# EAGLE design microframe (EAGLE 5.10)
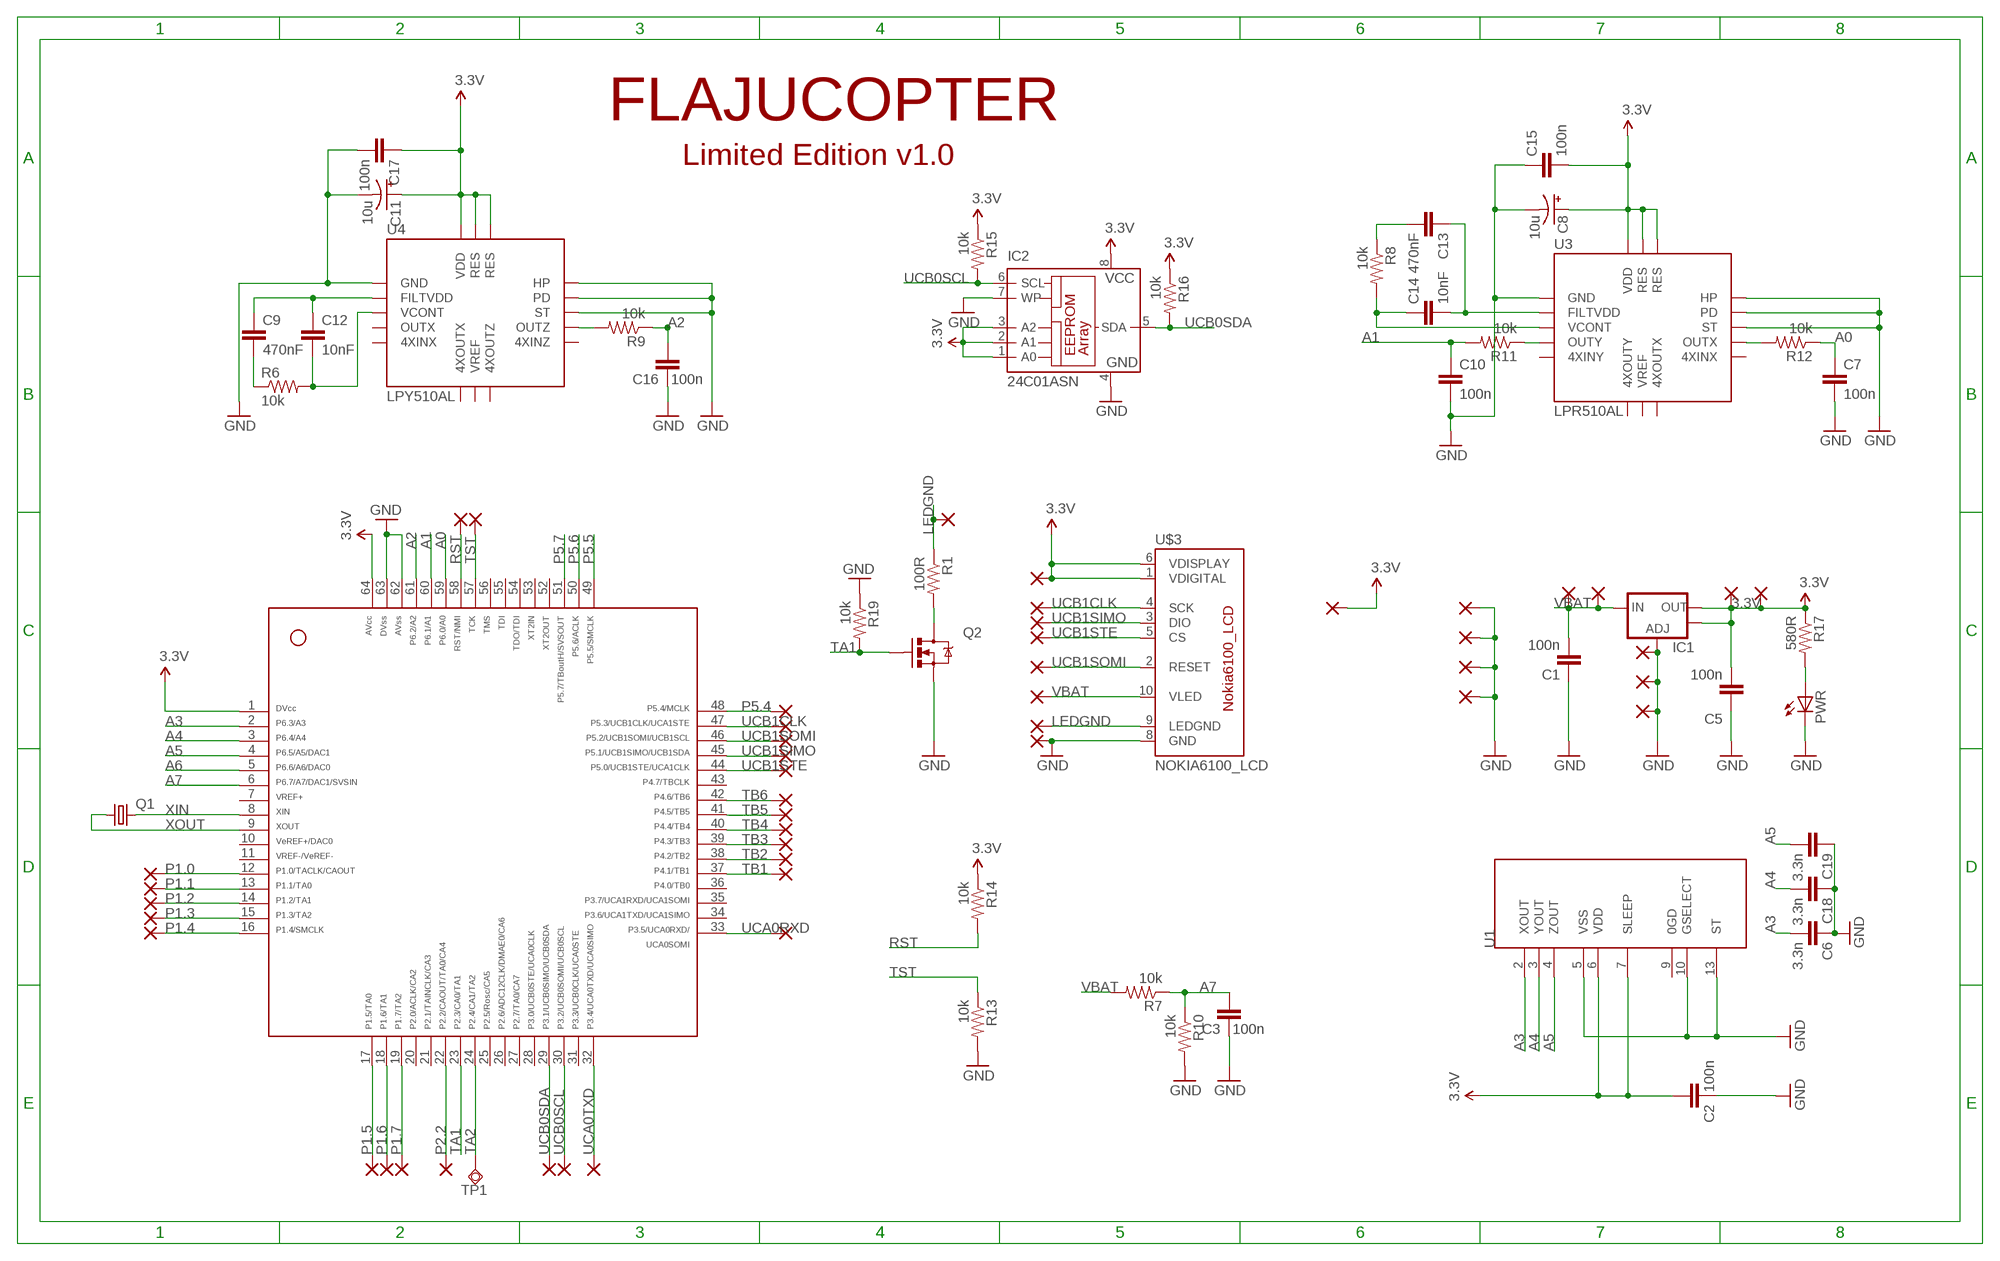
[diagram p0: schematic, sheet 1]

## Parts
C1  100n  CAP0805  [0805]
C2  100n  CAP0805  [0805]
C3  100n  CAP0805  [0805]
C5  100n  CAP0805  [0805]
C6  3.3n  CAP0805  [0805]
C7  100n  CAP0805  [0805]
C8  10u  CPOL-USCT3216  [CT3216]
C9  470nF  CAP0805  [0805]
C10  100n  CAP0805  [0805]
C11  10u  CPOL-USCT3216  [CT3216]
C12  10nF  CAP0805  [0805]
C13  470nF  CAP0805  [0805]
C14  10nF  CAP0805  [0805]
C15  100n  CAP0805  [0805]
C16  100n  CAP0805  [0805]
C17  100n  CAP0805  [0805]
C18  3.3n  CAP0805  [0805]
C19  3.3n  CAP0805  [0805]
IC1  V_REG_LM1117SOT223  [SOT223]
IC2  24C01ASN  [SO-08]
PAD1  SMD2  [SMD1,27-2,54]
PAD2  SMD2  [SMD1,27-2,54]
PAD3  SMD2  [SMD1,27-2,54]
PAD4  SMD2  [SMD1,27-2,54]
PAD5  SMD2  [SMD1,27-2,54]
PAD6  SMD2  [SMD1,27-2,54]
PAD7  SMD2  [SMD1,27-2,54]
PAD8  SMD2  [SMD1,27-2,54]
PAD9  SMD2  [SMD1,27-2,54]
PAD10  SMD2  [SMD1,27-2,54]
PAD11  SMD2  [SMD1,27-2,54]
PAD12  SMD2  [SMD1,27-2,54]
PAD13  SMD2  [SMD1,27-2,54]
PAD14  SMD2  [SMD1,27-2,54]
PAD15  SMD2  [SMD1,27-2,54]
PAD16  SMD2  [SMD1,27-2,54]
PAD17  SMD2  [SMD1,27-2,54]
PAD18  SMD2  [SMD1,27-2,54]
PAD19  SMD2  [SMD1,27-2,54]
PAD20  SMD2  [SMD1,27-2,54]
PAD21  SMD2  [SMD1,27-2,54]
PAD22  SMD2  [SMD1,27-2,54]
PAD23  SMD2  [SMD1,27-2,54]
PAD24  SMD2  [SMD1,27-2,54]
PAD25  SMD2  [SMD1,27-2,54]
PAD26  SMD2  [SMD1,27-2,54]
PAD27  SMD2  [SMD1,27-2,54]
PAD28  SMD2  [SMD1,27-2,54]
PAD29  SMD2  [SMD1,27-2,54]
PAD30  SMD2  [SMD1,27-2,54]
PAD31  SMD2  [SMD1,27-2,54]
PAD32  SMD2  [SMD1,27-2,54]
PAD33  SMD2  [SMD1,27-2,54]
PAD34  SMD2  [SMD1,27-2,54]
PAD35  SMD2  [SMD1,27-2,54]
PAD36  SMD2  [SMD1,27-2,54]
PAD37  SMD2  [SMD1,27-2,54]
PAD38  SMD2  [SMD1,27-2,54]
PAD39  SMD2  [SMD1,27-2,54]
PAD40  SMD2  [SMD1,27-2,54]
PAD41  SMD2  [SMD1,27-2,54]
PAD42  SMD2  [SMD1,27-2,54]
PAD43  SMD2  [SMD1,27-2,54]
PAD44  SMD2  [SMD1,27-2,54]
PAD45  SMD2  [SMD1,27-2,54]
PAD46  SMD2  [SMD1,27-2,54]
PAD47  SMD2  [SMD1,27-2,54]
PWR  LEDCHIPLED_0603  [CHIPLED_0603]
Q1  CRYSTALHC49S  [HC49/S]
Q2  MOSFET-NCHANNELSMD  [SOT23-3]
R1  100R  RESISTOR  [0805]
R6  10k  RESISTOR  [0805]
R7  10k  RESISTOR  [0805]
R8  10k  RESISTOR  [0805]
R9  10k  RESISTOR  [0805]
R10  10k  RESISTOR  [0805]
R11  10k  RESISTOR  [0805]
R12  10k  RESISTOR  [0805]
R13  10k  RESISTOR  [0805]
R14  10k  RESISTOR  [0805]
R15  10k  RESISTOR  [0805]
R16  10k  RESISTOR  [0805]
R17  580R  RESISTOR  [0805]
R19  10k  RESISTOR  [0805]
TP1  TPSQTP13R  [TP13R]
U1  MMA7361  [LGA14]
U3  LPR510AL  ST-GYRO-PRLGA  [ST-GYRO]
U4  LPY510AL  ST-GYRO-PYSMD  [ST-GYRO]
U$1  F261X---PM64  [PM/PAG64]
U$3  NOKIA6100_LCD  [NOKIA6100_LCD]

## Nets
3.3V: C2.2 C5.2 C8.+ C11.+ C15.2 C17.1 IC1.2(OUT) IC1.4(OUT) IC2.1(A0) IC2.2(A1) IC2.3(A2) IC2.8(VCC) PAD26.1(P) PAD28.1(P) PAD36.1(P) PAD44.1(P) R14.1 R15.1 R16.1 R17.1 U1.6(VDD) U1.7(SLEEP) U3.14(RES) U3.15(RES) U3.16(VDD) U4.14(RES) U4.15(RES) U4.16(VDD) U$1.1 U$1.64 U$3.1(VDIGITAL) U$3.6(VDISPLAY)
A0: C7.1 R12.1 U$1.59
A1: C10.1 R11.2 U$1.60
A2: C16.2 R9.1 U$1.61
A3: C6.2 U1.2(XOUT) U$1.2
A4: C18.2 U1.3(YOUT) U$1.3
A5: C19.2 U1.4(ZOUT) U$1.4
A6: U$1.5
A7: C3.2 R7.1 R10.1 U$1.6
GND: C1.1 C2.1 C3.1 C5.1 C6.1 C7.2 C8.- C10.2 C11.- C15.1 C16.1 C17.2 C18.1 C19.1 IC1.1(ADJ) IC2.4(GND) IC2.7(WP) PAD22.1(P) PAD23.1(P) PAD24.1(P) PAD25.1(P) PAD37.1(P) PAD43.1(P) PAD46.1(P) PAD47.1(P) PWR.C Q2.2(S) R10.2 R13.2 R19.1 U1.5(VSS) U1.10(GSELECT) U1.13(ST) U3.1(GND) U3.11(ST) U3.12(PD) U3.13(HP) U4.1(GND) U4.11(ST) U4.12(PD) U4.13(HP) U$1.62 U$1.63 U$3.8(GND)
LEDGND: PAD35.1(P) PAD45.1(P) R1.1 U$3.9(LEDGND)
N$1: C13.2 R8.1
N$2: R11.1 U3.4(OUTY)
N$3: PWR.A R17.2
N$4: Q2.3(D) R1.2
N$5: C9.1 C12.1 U4.2(FILTVDD)
N$10: C9.2 R6.1
N$12: C12.2 R6.2 U4.3(VCONT)
N$13: R9.2 U4.10(OUTZ)
N$14: C13.1 C14.2 U3.2(FILTVDD)
N$19: R12.2 U3.10(OUTX)
N$20: C14.1 R8.2 U3.3(VCONT)
P1.0: PAD1.1(P) U$1.12
P1.1: PAD2.1(P) U$1.13
P1.2: PAD3.1(P) U$1.14
P1.3: PAD4.1(P) U$1.15
P1.4: PAD5.1(P) U$1.16
P1.5: PAD6.1(P) U$1.17
P1.6: PAD7.1(P) U$1.18
P1.7: PAD8.1(P) U$1.19
P2.2: PAD9.1(P) U$1.22
P5.4: PAD29.1(P) U$1.48
P5.5: U$1.49
P5.6: U$1.50
P5.7: U$1.51
RST: PAD20.1(P) R14.2 U$1.58
TA1: Q2.1(G) R19.2 U$1.23
TA2: TP1.TP U$1.24
TB1: PAD10.1(P) U$1.37
TB2: PAD11.1(P) U$1.38
TB3: PAD12.1(P) U$1.39
TB4: PAD13.1(P) U$1.40
TB5: PAD14.1(P) U$1.41
TB6: PAD15.1(P) U$1.42
TST: PAD21.1(P) R13.1 U$1.57
UCA0RXD: PAD39.1(P) U$1.33
UCA0TXD: PAD38.1(P) U$1.32
UCB0SCL: IC2.6(SCL) PAD40.1(P) R15.2 U$1.30
UCB0SDA: IC2.5(SDA) PAD41.1(P) R16.2 U$1.29
UCB1CLK: PAD19.1(P) PAD30.1(P) U$1.47 U$3.4(SCK)
UCB1SIMO: PAD17.1(P) PAD31.1(P) U$1.45 U$3.3(DIO)
UCB1SOMI: PAD18.1(P) PAD33.1(P) U$1.46 U$3.2(RESET)
UCB1STE: PAD16.1(P) PAD32.1(P) U$1.44 U$3.5(CS)
VBAT: C1.2 IC1.3(IN) PAD27.1(P) PAD34.1(P) PAD42.1(P) R7.2 U$3.10(VLED)
XIN: Q1.2 U$1.8
XOUT: Q1.1 U$1.9
Unconnected: U1.9(0GD) U3.5(4XINY) U3.6(4XOUTY) U3.7(VREF) U3.8(4XOUTX) U3.9(4XINX) U4.4(OUTX) U4.5(4XINX) U4.6(4XOUTX) U4.7(VREF) U4.8(4XOUTZ) U4.9(4XINZ) U$1.7 U$1.10 U$1.11 U$1.20 U$1.21 U$1.25 U$1.26 U$1.27 U$1.28 U$1.31 U$1.34 U$1.35 U$1.36 U$1.43 U$1.52 U$1.53 U$1.54 U$1.55 U$1.56

## Notes on the sheet
- FLAJUCOPTER
- Limited Edition v1.0

## Library data of the parts
C1-C3 C5-C7 C9 C10 C12-C19 = SparkFun:CAP: Capacitor Standard 0603 ceramic capacitor, and 0.1" leaded capacitor.
C8 C11 = rcl:CPOL-US: POLARIZED CAPACITOR, American symbol
IC1 = SparkFun:V_REG_LM1117: Voltage Regulator LM1117 Standard adjustable voltage regulator but in SMD form. Spark Fun Electronics SKU : COM-00595
IC2 = microchip:24C*: Serial EEPROM 1 K/2 K/4 K
PAD1-PAD47 = wirepad:SMD2: SMD PAD
PWR = led:LED: LED OSRAM: - CHIPLED LG R971, LG N971, LY N971, LG Q971, LY Q971, LO R971, LY R971 LH N974, LH R974 LS Q976, LO Q976, LY Q976 LO Q996 - Hyper CHIPLED LW Q18S LB Q993, LB Q99A, LB R99A - SideLED LS A670, LO A670, LY A670, LG A670, LP A670 LB A673, LV A673, LT A673, LW A673 LH A674 LY A675 LS A676, LA A676, LO A676, LY A676, LW A676 LS A679, LY A679, LG A679 - Hyper Micro SIDELED® LS Y876, LA Y876, LO Y876, LY Y876 LT Y87S - SmartLED LW L88C, LW L88S LB L89C, LB L89S, LG L890 LS L89K, LO L89K, LY L89K LS L896, LA L896, LO L896, LY L896 - TOPLED LS T670, LO T670, LY T670, LG T670, LP T670 LSG T670, LSP T670, LSY T670, LOP T670, LYG T670 LG T671, LOG T671, LSG T671 LB T673, LV T673, LT T673, LW T673 LH T674 LS T676, LA T676, LO T676, LY T676, LB T676, LH T676, LSB T676, LW T676 LB T67C, LV T67C, LT T67C, LS T67K, LO T67K, LY T67K, LW E67C LS E67B, LA E67B, LO E67B, LY E67B, LB E67C, LV E67C, LT E67C LW T67C LS T679, LY T679, LG T679 LS T770, LO T770, LY T770, LG T770, LP T770 LB T773, LV T773, LT T773, LW T773 LH T774 LS E675, LA E675, LY E675, LS T675 LS T776, LA T776, LO T776, LY T776, LB T776 LHGB T686 LT T68C, LB T68C - Hyper Mini TOPLED® LB M676 - Mini TOPLED Santana® LG M470 LS M47K, LO M47K, LY M47K Source: http://www.osram.convergy.de LUXEON: - LUMILED® LXK2-PW12-R00, LXK2-PW12-S00, LXK2-PW14-U00, LXK2-PW14-V00 LXK2-PM12-R00, LXK2-PM12-S00, LXK2-PM14-U00 LXK2-PE12-Q00, LXK2-PE12-R00, LXK2-PE12-S00, LXK2-PE14-T00, LXK2-PE14-U00 LXK2-PB12-K00, LXK2-PB12-L00, LXK2-PB12-M00, LXK2-PB14-N00, LXK2-PB14-P00, LXK2-PB14-Q00 LXK2-PR12-L00, LXK2-PR12-M00, LXK2-PR14-Q00, LXK2-PR14-R00 LXK2-PD12-Q00, LXK2-PD12-R00, LXK2-PD12-S00 LXK2-PH12-R00, LXK2-PH12-S00 LXK2-PL12-P00, LXK2-PL12-Q00, LXK2-PL12-R00 Source: www.luxeon.com KINGBRIGHT: KA-3528ASYC Source: www.kingbright.com
Q1 = crystal:CRYSTAL: CRYSTAL
Q2 = SparkFun:MOSFET-NCHANNEL
R1 R6-R17 R19 = SparkFun:RESISTOR: Resistor Basic schematic elements and footprints for 0603, 1206, and PTH 1/10th watt (small) resistors.
TP1 = testpad:TPSQ: Test pad
U1 = SparkFun:MMA7361
U3 = SparkFun:ST-GYRO-PR
U4 = SparkFun:ST-GYRO-PY
U$1 = TI_MSP430_v15:F261X---PM64: ***MSP430F261x***PM64
U$3 = SparkFun:NOKIA6100_LCD: Nokia 6100 Color LCD Schematic element and footprint production proven but could use some touching up. Spark Fun Electronics SKU : LCD-00569. Mating SMD connector : LCD-00570

## Board
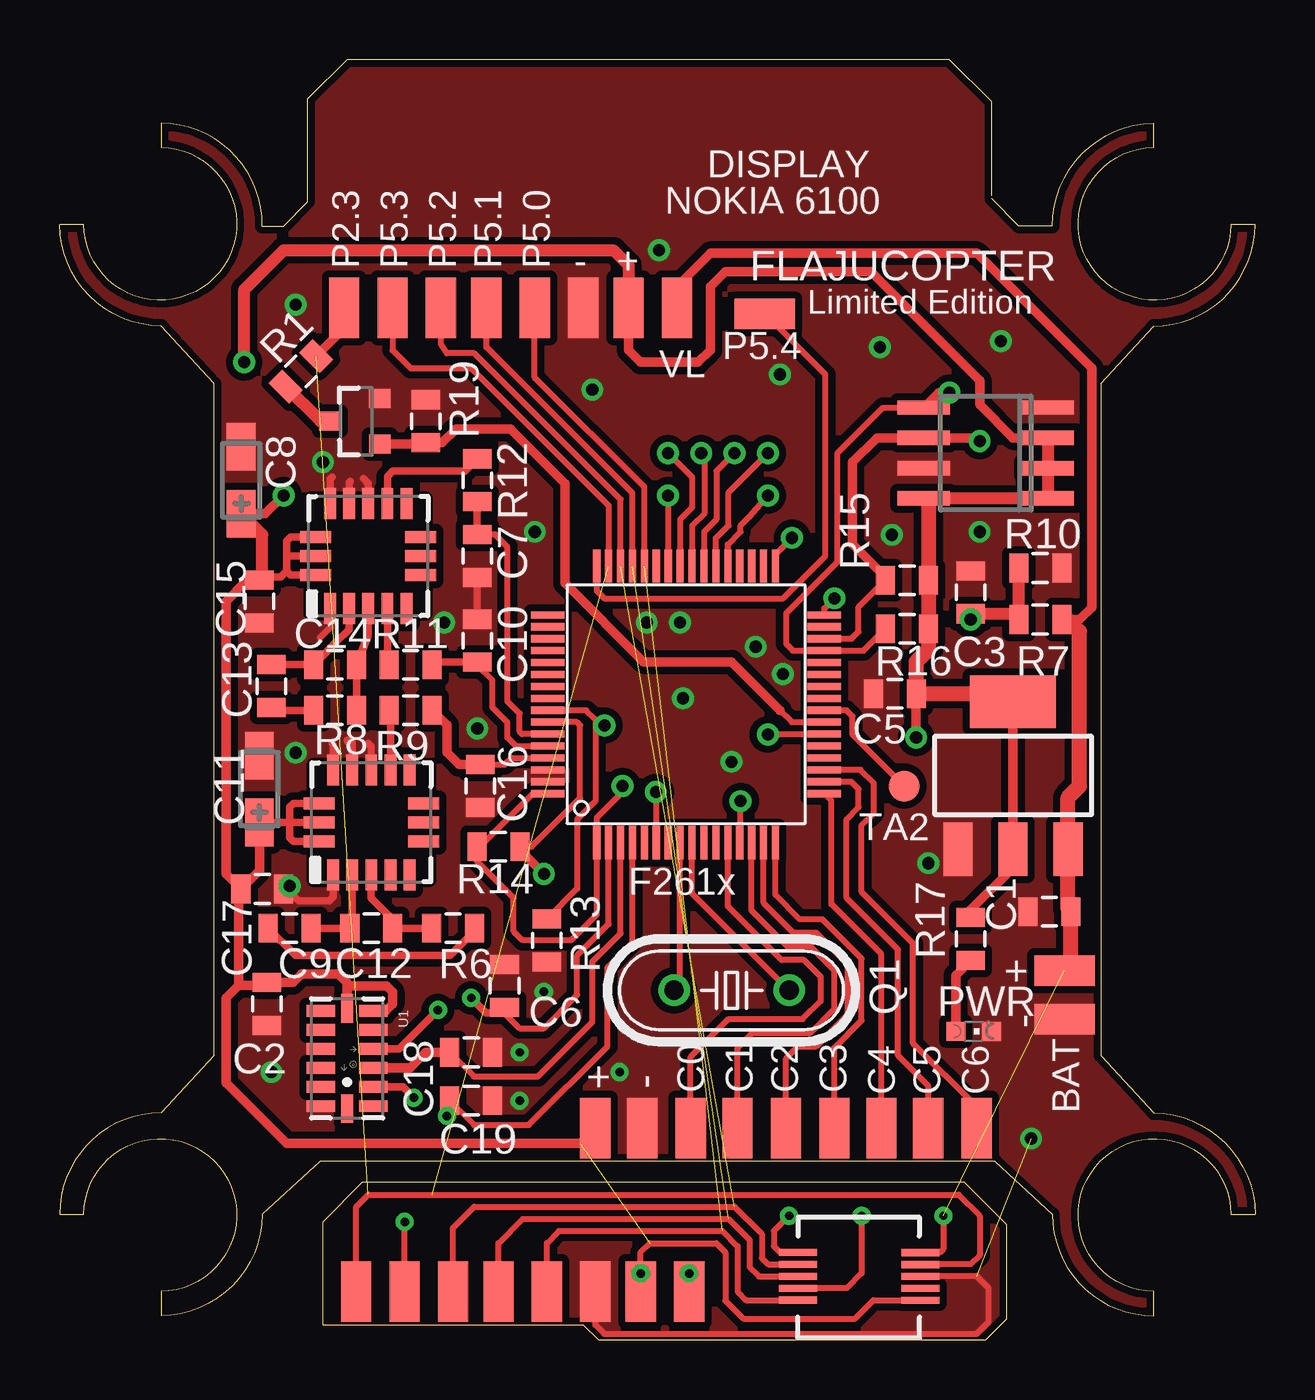
[diagram p1: board, top side]
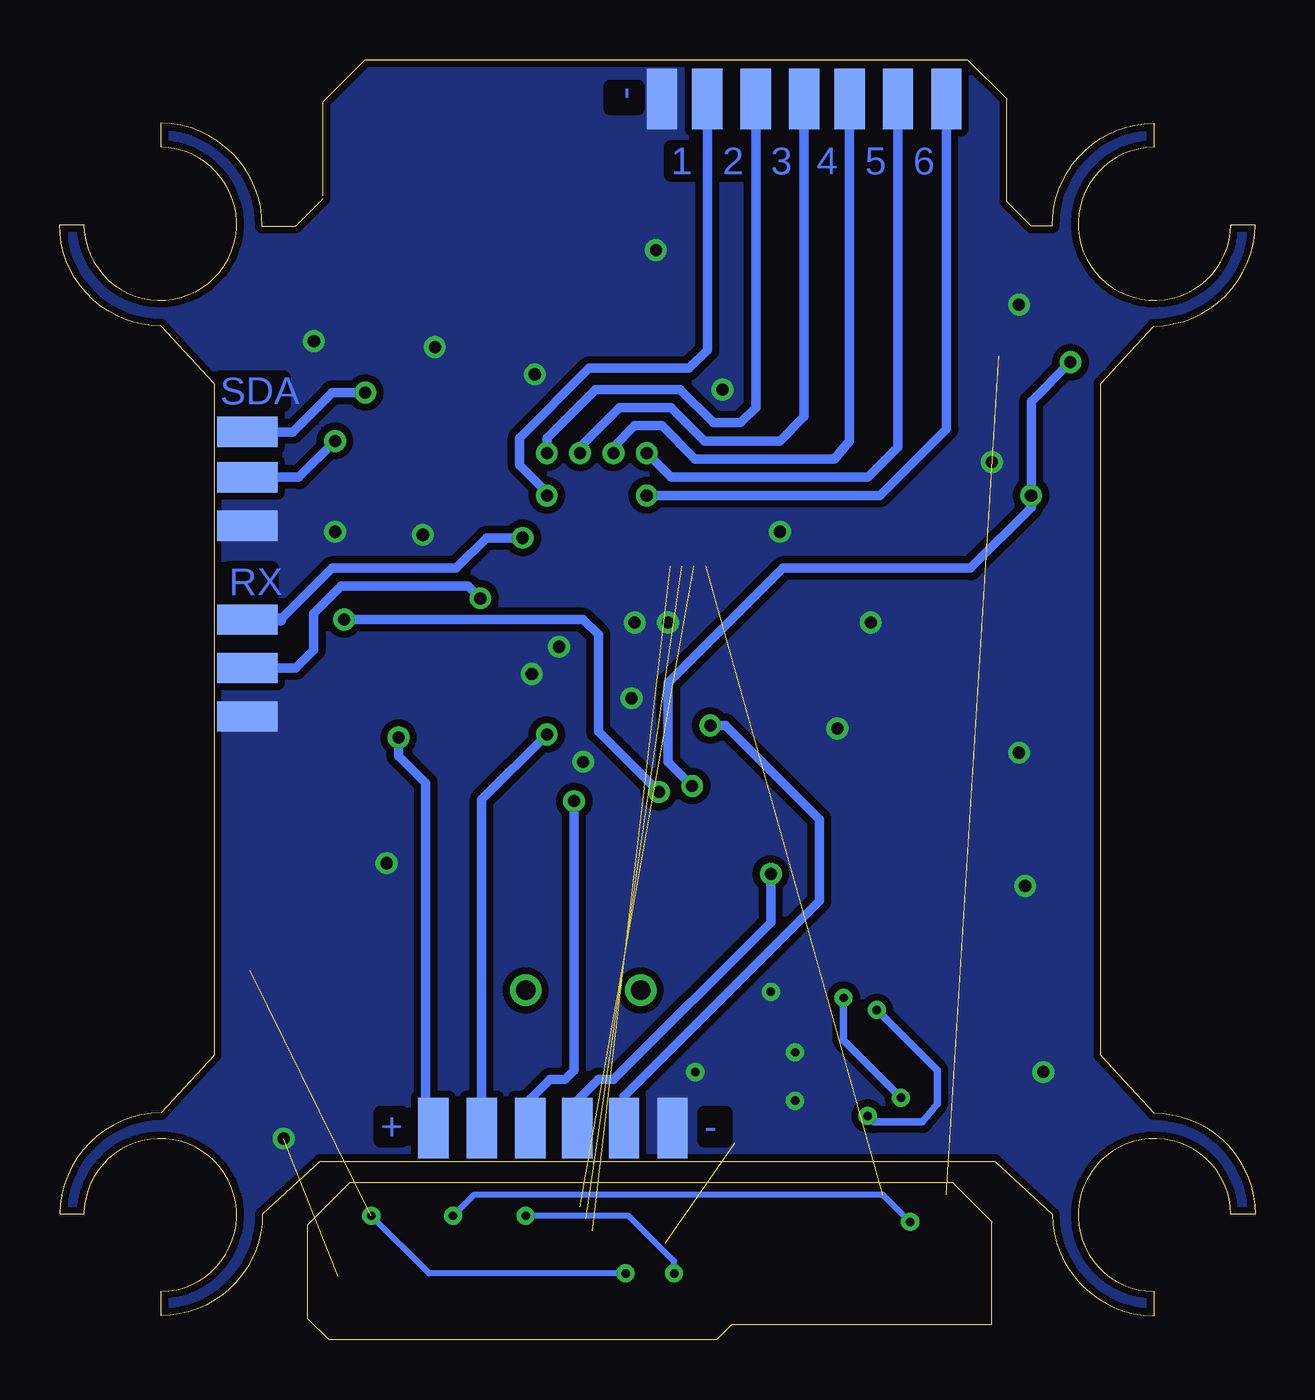
[diagram p2: board, bottom side, seen from below]

Size 50.17 x 53.72 mm. Coordinates in mm from the lower left corner, seen from the top.
Outline: 39.12,47.88 40.26,46.74 41.66,46.74 arc-89 45.91,51.05 45.91,50.04 arc269 49.15,46.8 50.17,46.8 arc-90 45.91,42.54 43.69,40.13 43.69,11.94 45.91,9.52 arc-89 50.17,5.27 49.15,5.27 arc269 45.91,2.03 45.91,1.02 arc-90 41.66,5.27 39.24,7.49 10.92,7.49 8.51,5.27 arc-89 4.25,1.02 4.25,2.03 arc269 1.02,5.27 0,5.27 arc-90 4.25,9.52 6.48,11.94 6.48,40.13 4.25,42.54 arc-89 0,46.8 1.02,46.8 arc269 4.25,50.04 4.25,51.05 arc-90 8.51,46.74 9.4,46.74 10.41,47.75 10.41,52.07 12.07,53.72 37.34,53.72 39.12,51.94 39.12,48.01
Outline: 39.75,4.83 37.97,6.6 12.7,6.6 11.05,4.95 11.05,0.63 21.97,0.63 22.61,0 38.86,0 39.75,0.89 39.75,4.83
Copper layers (1*16): Top 0.035mm / dielectric 1.5mm / Bottom 0.035mm
Design rules "default *": minimum track width 10mil, minimum drill 24mil, track to track 8mil, track to pad 8mil, pad to pad 8mil, via to via 8mil, smd to smd 8mil, copper to edge 5mil, drill to drill 8mil, minimum pad ring 10mil, minimum via ring 8mil, stop-mask expansion 4mil, vias tented up to drill 0mil, thermal gap 10mil
tRestrict: area 10.5,30.5 to 15.4,35.3; area 10.7,19.3 to 15.5,24.1; area 11.6,10.3 to 12.6,13.3

### Footprints (pad centres in the part's own frame; a part is rotated, then mirrored left to right if it is on the bottom)
0805 = smd 0.8 x 1.2: 1 -0.9,0; 2 0.9,0
CT3216 = smd 2 x 1.2: + -1.4,0; - 1.4,0
SOT223 = smd 1.219 x 2.235: 1 -2.311,-3.099; 2 0,-3.099; 3 2.311,-3.099 | smd 3.6 x 2.2: 4 0,3.099
SO-08 = smd 0.6 x 2.2: 1 -1.905,-2.6; 2 -0.635,-2.6; 3 0.635,-2.6; 4 1.905,-2.6; 5 1.905,2.6; 6 0.635,2.6; 7 -0.635,2.6; 8 -1.905,2.6
SMD1,27-2,54 = smd 1.27 x 2.54: 1 0,0
CHIPLED_0603 = smd 0.8 x 0.8: A 0,-0.75; C 0,0.75
HC49/S = drill 0.813 round: 1 -2.413,0; 2 2.413,0
SOT23-3 = smd 0.8 x 0.9: 1 -0.95,-1; 2 0.95,-1; 3 0,1.1
TP13R = smd 1.3 x 1.3: TP 0,0
LGA14 = smd 0.5 x 1.2: 1 2,1.1; 2 1.2,1.1; 3 0.4,1.1; 4 -0.4,1.1; 5 -1.2,1.1; 6 -2,1.1; 8 -2,-1.1; 9 -1.2,-1.1; 10 -0.4,-1.1; 11 0.4,-1.1; 12 1.2,-1.1; 13 2,-1.1 | smd 1.2 x 0.5: 7 -2.1,0; 14 2.1,0
ST-GYRO = smd 1.3 x 0.5: 1 -2.2,1.6; 2 -2.2,0.8; 3 -2.2,0; 4 -2.2,-0.8; 5 -2.2,-1.6; 9 2.2,-1.6; 10 2.2,-0.8; 11 2.2,0; 12 2.2,0.8; 13 2.2,1.6 | smd 0.5 x 1.3: 6 -0.8,-2.2; 7 0,-2.2; 8 0.8,-2.2; 14 0.8,2.2; 15 0,2.2; 16 -0.8,2.2
PM/PAG64 = smd 1.4 x 0.3: 1 -5.8,3.75; 2 -5.8,3.25; 3 -5.8,2.75; 4 -5.8,2.25; 5 -5.8,1.75; 6 -5.8,1.25; 7 -5.8,0.75; 8 -5.8,0.25; 9 -5.8,-0.25; 10 -5.8,-0.75; 11 -5.8,-1.25; 12 -5.8,-1.75; 13 -5.8,-2.25; 14 -5.8,-2.75; 15 -5.8,-3.25; 16 -5.8,-3.75; 33 5.8,-3.75; 34 5.8,-3.25; 35 5.8,-2.75; 36 5.8,-2.25; 37 5.8,-1.75; 38 5.8,-1.25; 39 5.8,-0.75; 40 5.8,-0.25; 41 5.8,0.25; 42 5.8,0.75; 43 5.8,1.25; 44 5.8,1.75; 45 5.8,2.25; 46 5.8,2.75; 47 5.8,3.25; 48 5.8,3.75 | smd 0.3 x 1.4: 17 -3.75,-5.8; 18 -3.25,-5.8; 19 -2.75,-5.8; 20 -2.25,-5.8; 21 -1.75,-5.8; 22 -1.25,-5.8; 23 -0.75,-5.8; 24 -0.25,-5.8; 25 0.25,-5.8; 26 0.75,-5.8; 27 1.25,-5.8; 28 1.75,-5.8; 29 2.25,-5.8; 30 2.75,-5.8; 31 3.25,-5.8; 32 3.75,-5.8; 49 3.75,5.8; 50 3.25,5.8; 51 2.75,5.8; 52 2.25,5.8; 53 1.75,5.8; 54 1.25,5.8; 55 0.75,5.8; 56 0.25,5.8; 57 -0.25,5.8; 58 -0.75,5.8; 59 -1.25,5.8; 60 -1.75,5.8; 61 -2.25,5.8; 62 -2.75,5.8; 63 -3.25,5.8; 64 -3.75,5.8
NOKIA6100_LCD = smd 1.6 x 0.3: 1 -2.415,1.131; 2 -2.415,0.631; 3 -2.415,0.131; 4 -2.415,-0.369; 5 -2.415,-0.869; 6 2.719,-0.877; 7 2.719,-0.377; 8 2.719,0.123; 9 2.719,0.623; 10 2.719,1.123

### Placement (x,y rotation side)
C1  41.53,17.97 0 top
C2  8.7,14.1 90 top
C3  38.23,31.37 270 top
C5  35.05,27.11 0 top
C6  18.67,14.86 270 top
C7  17.53,32.89 270 top
C8  7.62,36.07 90 top
C9  9.65,17.27 180 top
C10  17.53,29.34 90 top
C11  8.38,23.11 90 top
C12  13.08,17.27 0 top
C13  8.89,27.43 270 top
C14  11.56,28.32 180 top
C15  8.38,30.99 90 top
C16  17.65,23.24 90 top
C17  8.51,18.92 0 top
C18  17.27,12.06 180 top
C19  17.27,10.03 180 top
IC1  40,23.69 0 top
IC2  38.86,37.21 90 top
PAD1  26.48,8.89 0 top
PAD2  30.42,8.89 0 bottom
PAD3  28.45,8.89 0 top
PAD4  30.48,8.89 0 top
PAD5  32.51,8.89 0 top
PAD6  34.48,8.89 180 top
PAD7  36.45,8.89 0 top
PAD8  38.48,8.89 0 top
PAD9  32.45,8.89 0 bottom
PAD10  22.99,52.07 0 bottom
PAD11  20.95,52.07 0 bottom
PAD12  18.92,52.07 0 bottom
PAD13  17.02,52.07 0 bottom
PAD14  14.99,52.07 0 bottom
PAD15  12.95,52.07 0 bottom
PAD16  19.94,43.31 0 top
PAD17  18.41,2.03 0 top
PAD18  16,43.31 0 top
PAD19  13.97,43.31 0 top
PAD20  28.45,8.89 0 bottom
PAD21  26.48,8.89 0 bottom
PAD22  24.45,8.89 0 bottom
PAD23  42.17,13.45 90 top
PAD24  24.89,52.07 180 bottom
PAD25  24.45,8.89 0 top
PAD26  34.48,8.89 0 bottom
PAD27  42.16,15.49 90 top
PAD28  22.48,8.89 0 top
PAD29  29.59,43.05 90 top
PAD30  14.48,2.03 0 top
PAD31  17.91,43.31 0 top
PAD32  20.45,2.03 0 top
PAD33  16.51,2.03 0 top
PAD34  25.91,43.31 0 top
PAD35  11.94,43.31 0 top
PAD36  23.88,43.31 0 top
PAD37  21.97,43.31 0 top
PAD38  42.29,28.19 270 bottom
PAD39  42.29,30.23 270 bottom
PAD40  42.29,36.2 270 bottom
PAD41  42.29,38.1 270 bottom
PAD42  26.42,2.03 0 top
PAD43  22.48,2.03 0 top
PAD44  24.38,2.03 0 top
PAD45  12.45,2.03 0 top
PAD46  42.29,26.16 270 bottom
PAD47  42.29,34.16 270 bottom
PWR  38.35,12.95 270 top
Q1  28.19,14.67 180 top
Q2  12.45,38.54 90 top
R1  10.13,40.64 225 top
R6  16.51,17.27 180 top
R7  41.15,30.23 0 top
R8  11.56,26.42 0 top
R9  14.73,26.42 180 top
R10  41.15,32.38 0 top
R11  14.73,28.32 0 top
R12  17.53,36.07 90 top
R13  20.45,16.76 270 top
R14  18.41,20.7 0 top
R15  35.56,31.88 180 top
R16  35.56,29.84 180 top
R17  38.23,16.83 270 top
R19  15.37,38.54 270 top
TP1  35.43,23.24 0 top
U1  12.07,11.81 270 top
U3  12.95,32.89 90 top
U4  13.08,21.72 90 top
U$1  26.29,26.67 90 top
U$3  33.4,2.54 0 top

### Tracks (layer width: path | path; a pad name or v marks a point on that pad's centre or on a via)
3.3V  (via drill 0.36, 0.51)  (1 unrouted)
  Top 0.254: U$1.64 19.87,22.92 17.65,20.7 R14.1 17.53,20.07 19.05,18.54 19.05,17.14 19.43,16.76 21.46,16.76 22.54,17.84 U$1.1 22.54,21.9 23.62,22.99 v23.62,23.24 | U$3.6 34.15,1.66 33.38,0.89 28.7,0.89 27.94,1.65 27.94,3.68 27.56,4.06 24.77,4.06 24.38,3.68 v24.38,2.79 PAD44.1 | U$3.1 31.06,3.68 30.23,3.68 29.97,3.94 29.97,4.57 v30.61,5.21
  Top 0.305: 9.65,21.72 U4.15 | 9.65,21.72 C11.+ | U4.14 9.82,22.52 9.65,22.35 9.65,21.72 | U4.16 9.82,20.92 9.65,21.08 9.65,21.72 | 9.53,32.89 U3.15 | 9.53,32.89 9.53,33.53 9.69,33.69 U3.14 | U3.16 9.69,32.09 9.53,32.26 | 9.53,32.26 9.53,32.89 | C17.1 7.62,18.91 | 8.51,32.01 9.28,32.01 9.53,32.26
  Top 0.406: R17.1 38.23,18.03 40,19.81 IC1.2 IC1.4 39.67,27.11 | PAD28.1 21.84,8.25 9.53,8.25 6.99,10.79 6.99,14.35 7.5,14.87 | C15.2 8.24,31.75 7.75,31.75 6.99,30.99 6.99,19.55 C17.1 | C11.+ 8.38,19.7 C17.1 | 35.94,27.13 v35.94,25.27 | IC2.3 40,37.85 38.61,39.24 38.61,40.26 34.04,44.83 27.94,44.83 27.3,44.2 27.3,41.53 26.8,41.02 24.38,41.02 23.88,41.53 PAD36.1 | C8.+ 8.63,34.67 v9.4,35.43 | C17.1 7.5,18.92 7.5,14.87 | 7.5,14.87 8.7,14.87 C2.2 9.79,15 10.16,15.37 11.68,15.37 12.07,14.99 | 12.07,14.99 U1.7 | U1.6 13.68,13.81 13.97,14.1 13.97,14.61 13.72,14.86 12.19,14.86 12.07,14.99
  Top 0.508: C8.+ 8.51,33.78 8.51,32.01 C15.2 | IC2.8 IC2.1 IC2.2 IC2.3 | PAD36.1 23.88,45.09 23.24,45.72 9.4,45.72 7.75,44.07 v7.75,41.02
  Top 0.635: 39.67,27.11 C5.2 35.94,27.13 35.94,28.45 36.46,28.97 R16.1 R15.1 36.46,35.11 IC2.8
  Bottom 0.254: v30.61,5.21 26.29,5.21 24.38,3.3 v24.38,2.79
  Bottom 0.406: v35.94,25.27 35.94,24.51 34.8,23.37 34.8,9.21 PAD26.1 | v23.62,23.24 24.64,24.26 24.64,27.56 19.81,32.38 11.94,32.38 9.4,34.92 v9.4,35.43 9.4,39.37 v7.75,41.02
A0
  Top 0.254: U$1.59 19.41,25.42 19.3,25.53 19.3,26.29 18.8,26.8 18.8,33.27 18.28,33.79 C7.1
  Top 0.305: C7.1 R12.1
A1
  Top 0.254: U$1.60 19.15,24.92 18.8,25.27 18.8,25.91 18.16,26.54 18.16,27.69 17.53,28.32 C10.1
  Top 0.305: C10.1 15.64,28.44 R11.2
A2
  Top 0.254: U$1.61 18.96,24.42 18.68,24.14 C16.2
  Top 0.406: R9.1 16.26,25.79 16.26,24.64 16.75,24.14 C16.2
A3  (via drill 0.36)
  Top 0.254: C6.2 18.66,13.73 19.3,13.08 20.32,13.08 21.72,14.48 21.72,16.13 23.04,17.45 U$1.2
  Top 0.305: 18.66,13.73 17.9,13.73 v17.27,14.35 | v14.86,10.16 14.41,10.61 U1.2
  Bottom 0.305: v17.27,14.35 17.27,12.57 v14.86,10.16
A4
  Top 0.254: C18.2 17.39,11.05 20.07,11.05 22.35,13.33 22.35,15.88 23.54,17.06 U$1.3
  Top 0.305: C18.2 16.3,11.99
  Top 0.406: U1.3 14.71,11.41 15.37,12.06 C18.2
A5  (via drill 0.36)
  Top 0.254: C19.2 17.39,9.02 19.69,9.02 22.99,12.32 22.99,15.62 24.04,16.67 U$1.4
  Top 0.305: C19.2 16.26,9.92 v16.26,9.4 | v15.88,13.84 14.24,12.21 U1.4
  Bottom 0.305: v16.26,9.4 16,9.14 13.97,9.14 13.34,9.91 13.34,11.3 v15.88,13.84
A7  (via drill 0.51)
  Top 0.254: v25.02,22.99 25.04,22.97 U$1.6 | 38.47,30.47 38.48,30.48
  Top 0.406: v38.23,30.23 C3.2
  Top 0.508: R10.1 R7.1 40,30.47 38.47,30.47 C3.2
  Bottom 0.406: v38.23,30.23 28.19,30.23 27.56,29.59 27.56,25.53 v25.02,22.99
GND  (via drill 0.36, 0.51)  (1 unrouted)
  Top 0.254: U3.1 11.35,29.9 10.92,29.46 | PAD43.1 22.48,0.63 22.86,0.25 38.48,0.25 38.99,0.76 38.99,2.16 38.48,2.67 36.19,2.67 U$3.8
  Top 0.305: 11.31,35.05 U3.13 11.35,36.12 11.43,36.2 | C10.2 C7.2 | C17.2 10.04,18.41 11.3,18.41 11.48,18.59 U4.1 | U4.13 11.48,24.97 11.43,25.02 | 12.19,25.15 12.28,25.06 U4.12 12.28,24.93 12.07,25.15 | U4.11 13.08,24.89 12.95,25.02 | U3.12 12.15,35.97 12.19,36 | U3.11 12.95,35.94 12.76,36.13
  other vias: 20.32,14.61 19.3,12.06 19.3,10.03 16.13,30.1 9.91,24.64 9.65,19.05 8.89,11.24 26.16,26.92 23.5,11.24 40.77,8.45 36.45,20 30.35,27.94 19.94,33.91 17.53,25.65 30.23,40.51 29.21,29.08 24.64,30.1 26.04,30.1 28.19,24.26 38.61,33.91 39.5,41.91 22.35,39.88 9.91,43.43 34.92,33.78 25.15,45.72 34.42,41.66 11.05,36.83
  pour Top (isolate 0.305, no thermals): 50.67,44.83 44.2,38.35 44.2,13.46 50.23,7.43 50.67,5.08 46.48,0.63 40.64,0.76 39.5,-0.38 10.92,-0.38 9.65,0.89 3.94,0.76 -0.51,4.44 -0.44,7.3 6.22,13.97 6.22,38.35 -0.13,44.7 -0.25,46.86 4.06,51.43 7.87,50.42 12.07,53.97 37.21,53.97 46.23,51.56 50.67,46.86
  pour Bottom (isolate 0.305, no thermals): -0.13,44.58 6.1,38.35 6.1,13.97 -0.63,7.24 -0.38,4.57 3.94,0.63 9.59,0.95 10.92,-0.38 39.37,-0.38 40.39,0.63 46.48,0.76 50.67,5.33 50.17,7.24 44.45,12.95 44.45,38.73 50.55,44.83 50.67,46.86 46.86,51.43 37.34,53.85 12.19,54.1 8,50.29 3.94,51.43 -0.25,46.86
LEDGND  (1 unrouted)
  Top 0.254: PAD45.1 12.45,5.59 12.95,6.1 37.72,6.1 38.61,5.21 38.61,3.56 38.23,3.17 36.2,3.17 U$3.9
  Top 0.406: R1.1 11.94,42.45 PAD35.1
N$1
  Top 0.305: R8.1 9.01,26.42 C13.2
N$2
  Top 0.305: U3.4 13.75,28.53 R11.1
N$3
  Top 0.406: R17.2 37.6,15.3 PWR.A
N$4
  Top 0.508: Q2.3 10.95,38.55 R1.2
N$5
  Top 0.305: U4.2 12.28,17.24 C12.1 C9.1
N$10
  Top 0.305: C9.2 9.89,16.13 16.38,16.13 17.4,17.14 R6.1
N$12
  Top 0.305: U4.3 13.08,18.54 13.97,17.65 13.97,17.16 C12.2 R6.2
N$13
  Top 0.305: U4.10 13.88,26.11 R9.2
N$14
  Top 0.305: U3.2 12.15,29.81 11.94,29.59 11.8,29.46 C14.2 10.65,28.33 C13.1
N$19
  Top 0.305: U3.10 13.75,36.23 13.97,36.45 17.01,36.45 R12.2
N$20
  Top 0.305: U3.3 12.95,29.58 C14.1 R8.2
P1.0
  Top 0.254: U$1.12 28.04,18.19 30.29,15.94 31.24,15.94 31.94,15.24 31.94,14.22 31.18,13.46 28.07,13.46 26.48,11.87 PAD1.1
P1.1  (via drill 0.51)
  Top 0.254: v28.57,22.61 28.54,22.57 U$1.13
  Bottom 0.406: PAD2.1 30.42,10.1 29.59,10.92 28.96,10.92 28.57,11.3 v28.57,22.61
P1.2
  Top 0.254: PAD3.1 28.45,12.26 29.08,12.89 31.5,12.89 32.51,13.91 32.51,15.49 31.5,16.51 30.54,16.51 29.04,18.02 U$1.14
P1.3
  Top 0.254: U$1.15 29.54,18.34 30.8,17.08 31.75,17.08 33.08,15.75 33.08,13.65 31.75,12.32 30.99,12.32 30.48,11.81 PAD4.1
P1.4
  Top 0.254: U$1.16 30.04,18.67 31.05,17.65 32,17.65 33.66,16 33.66,13.4 32.51,12.26 PAD5.1
P1.5
  Top 0.254: PAD6.1 34.48,16.19 32.39,18.29 32.39,22.62 U$1.17
P1.6
  Top 0.254: PAD7.1 36.45,10.67 35.18,11.94 35.18,16.38 33.02,18.54 33.02,21.84 33.53,22.35 33.53,23.11 33.22,23.42 U$1.18
P1.7
  Top 0.254: U$1.19 33.61,23.92 34.16,23.37 34.16,22.1 33.66,21.59 33.66,18.8 35.81,16.64 35.81,12.45 38.48,9.78 PAD8.1
P2.2  (via drill 0.51)
  Top 0.254: v29.72,25.4 29.74,25.42 U$1.22
  Bottom 0.406: PAD9.1 32.45,22.67 v29.72,25.4
P5.4
  Top 0.254: U$1.48 22.54,31.44 22.86,31.12 30.35,31.12 32.13,32.89 32.13,40.51 PAD29.1
RST  (via drill 0.51)
  Top 0.254: U$1.58 21.7,25.92 21.84,25.78 21.84,22.73 19.81,20.7 R14.2
  Top 0.406: v20.32,19.56 19.3,20.59 R14.2
  Bottom 0.406: PAD20.1 28.45,10.03 27.56,10.92 26.92,10.92 20.32,17.53 v20.32,19.56
TA1
  Top 0.254: 30.23,26.42 30.72,25.92 U$1.23
  Top 0.406: 30.23,26.42 28.19,28.45 24.51,28.45 21.21,31.75 21.21,35.94 18.92,38.23 16.64,38.23 16.05,37.64 R19.2 15.32,37.59 Q2.1
TA2
  Top 0.254: U$1.24 33.02,26.42 33.27,26.16 33.27,25.4 TP1.TP
TB1  (via drill 0.51)
  Top 0.254: v29.72,35.43 28.96,34.54 28.57,34.16 28.57,33.91 28.04,33.37 U$1.37
  Bottom 0.406: PAD10.1 22.99,41.53 23.75,40.77 27.94,40.77 30.86,37.85 30.86,36.7 29.72,35.56 v29.72,35.43
TB2  (via drill 0.51)
  Top 0.254: v29.72,37.21 28.07,35.56 28.07,34.16 27.54,33.63 U$1.38
  Bottom 0.406: PAD11.1 20.95,39.12 21.59,38.48 22.73,38.48 24.13,39.88 27.69,39.88 29.72,37.85 v29.72,37.21
TB3  (via drill 0.51)
  Top 0.254: U$1.39 27.04,33.9 27.56,34.42 27.56,36.45 v28.32,37.21
  Bottom 0.406: v28.32,37.21 28.32,37.46 26.67,39.12 24.51,39.12 23.11,37.72 19.94,37.72 18.92,38.73 PAD12.1
TB4  (via drill 0.51)
  Top 0.254: v26.92,37.21 27.05,37.08 27.05,34.67 26.54,34.16 U$1.40
  Bottom 0.406: PAD13.1 17.02,37.72 17.65,36.96 23.5,36.96 24.89,38.35 26.04,38.35 26.92,37.46 v26.92,37.21
TB5  (via drill 0.51)
  Top 0.254: v25.53,37.21 26.54,36.2 26.54,34.92 26.04,34.42 U$1.41
  Bottom 0.406: PAD14.1 14.99,37.46 16.26,36.2 24.51,36.2 v25.53,37.21
TB6  (via drill 0.51)
  Top 0.254: v25.53,35.43 25.54,34.53 U$1.42
  Bottom 0.406: PAD15.1 12.95,38.23 15.75,35.43 v25.53,35.43
TST  (via drill 0.51)
  Top 0.254: U$1.57 22.09,26.42 22.48,26.03 | R13.1 21.72,18.93 21.72,21.84 22.48,22.61 22.48,26.03 | 22.48,26.03 22.73,25.78 v22.86,25.78
  Bottom 0.406: PAD21.1 26.48,10.22 18.29,18.41 18.29,21.84 22.23,25.78 v22.86,25.78
UCA0RXD  (via drill 0.51)
  Top 0.254: U$1.33 30.06,32.98 v30.73,33.66
  Bottom 0.406: v30.73,33.66 32.26,33.66 33.53,32.38 38.73,32.38 40.89,30.23
  Bottom 0.508: 40.89,30.23 PAD39.1
UCA0TXD  (via drill 0.51)
  Top 0.254: U$1.32 32.09,30.69 v32.51,31.12
  Bottom 0.406: v32.51,31.12 33.02,31.62 38.35,31.62 39.5,30.48 39.5,28.96 40.26,28.19 PAD38.1
UCB0SCL  (via drill 0.51)
  Top 0.254: U$1.30 33.23,29.42 33.53,29.72 33.53,30.74 R15.2
  Top 0.406: R15.2 34.66,32.02 33.27,33.4 33.27,36.83 34.29,37.85 IC2.6 38.48,37.85 v38.61,37.72
  Bottom 0.406: PAD40.1 40.13,36.2 v38.61,37.72
UCB0SDA  (via drill 0.51)
  Top 0.254: R16.2 33.73,28.92 U$1.29 30.77,28.92 30.48,29.21 30.48,30.48 32.64,32.64 32.64,37.21 34.54,39.12 IC2.5
  Top 0.406: IC2.5 36.9,39.75 v37.34,39.75
  Bottom 0.406: v37.34,39.75 38.73,39.75 40.39,38.1 PAD41.1
UCB1CLK  (via drill 0.36)  (1 unrouted)
  Top 0.254: U$1.47 23.04,35 17.27,40.77 14.73,40.77 13.97,41.53 PAD19.1 | PAD30.1 v14.48,4.95 | v33.66,5.21 33.66,2.79 33.03,2.17 U$3.4
  Bottom 0.254: v14.48,4.95 15.62,6.1 32.77,6.1 v33.66,5.21
UCB1SIMO  (1 unrouted)
  Top 0.254: U$1.45 24.04,35.52 17.91,41.66 PAD31.1 | PAD17.1 18.41,4.06 19.43,5.08 28.07,5.08 28.96,4.19 28.96,3.05 29.34,2.67 31.05,2.67 U$3.3
UCB1SOMI  (1 unrouted)
  Top 0.254: U$1.46 23.54,35.26 17.4,41.4 16.26,41.4 16,41.78 PAD18.1 | PAD33.1 16.51,4.7 17.4,5.59 28.32,5.59 29.46,4.44 29.46,3.43 29.72,3.17 31.05,3.17 U$3.2
UCB1STE  (1 unrouted)
  Top 0.254: U$1.44 24.54,35.79 19.94,40.39 PAD16.1 | PAD32.1 20.45,4.06 20.95,4.57 27.81,4.57 28.45,3.94 28.45,2.03 28.81,1.67 U$3.5
VBAT  (via drill 0.36)  (1 unrouted)
  Top 0.254: PAD42.1 v26.42,2.79 | v37.08,5.21 37.08,3.81 36.96,3.68 36.2,3.68 U$3.10
  Top 0.406: PAD27.1 42.43,15.76 | C1.2 42.32,18.08 | PAD34.1 25.91,44.2 27.3,45.59 38.48,45.59 43.31,40.77 43.31,30.73 42.8,30.23 R7.2
  Top 0.635: 42.43,15.76 C1.2 | 42.32,18.08 IC1.3 42.32,22.76 42.8,23.24 42.8,29.73 42.3,30.23 R7.2
  Bottom 0.254: v26.42,2.79 34.67,2.79 v37.08,5.21
XIN
  Top 0.254: U$1.8 26.04,14.93 Q1.2
XOUT
  Top 0.254: U$1.9 26.54,18.74 Q1.1

### Text on the board
Bottom: - | 6 | 5 | 4 | 3 | 2 | 1 | SDA | RX | - | +
tNames: DISPLAY | NOKIA 6100 | P2.3 | P5.3 | P5.2 | P5.1 | P5.0 | - | + | FLAJUCOPTER | Limited Edition | P5.4 | VL | TA2 | F261x | + | - | C0 | C1 | C2 | C3 | - | + | C4 | C5 | C6 | BAT
_tNames: R1 | R19 | C8 | R15 | C7 | R12 | R10 | C14 | C13 | C15 | R11 | R16 | C10 | C3 | R7 | R9 | R8 | C5 | C11 | C16 | R14 | R13 | R17 | C1 | C9 | R6 | Q1 | C17 | C12 | PWR | C18 | C6 | C2 | C19